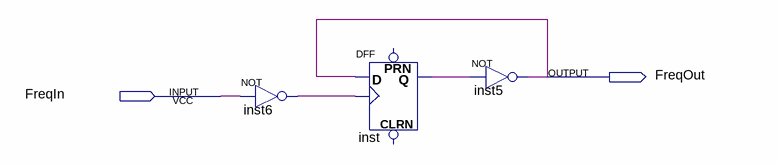
[diagram p0: schematic sheet]
// Quartus schematic FreqDivider.bdf as structural Verilog: 3 symbols, 2 pins
module FreqDivider (
  input  FreqIn,
  output FreqOut
);

  wire inst6_out, inst_q;

  not inst6 (inst6_out, FreqIn);
  DFF inst (.CLK(inst6_out), .D(FreqOut), .Q(inst_q));  // open: CLRN, PRN
  not inst5 (FreqOut, inst_q);
endmodule
